# EasyEDA schematic SCH_ESP32-S2-UNO_Final_2023-12-28.json
TITLE: ESP32-32-CONTROL; REV: 1.0; Date: 2023-12-15; Sheet: 1/1; Drawn By: mubashirlio; Company: Your Company
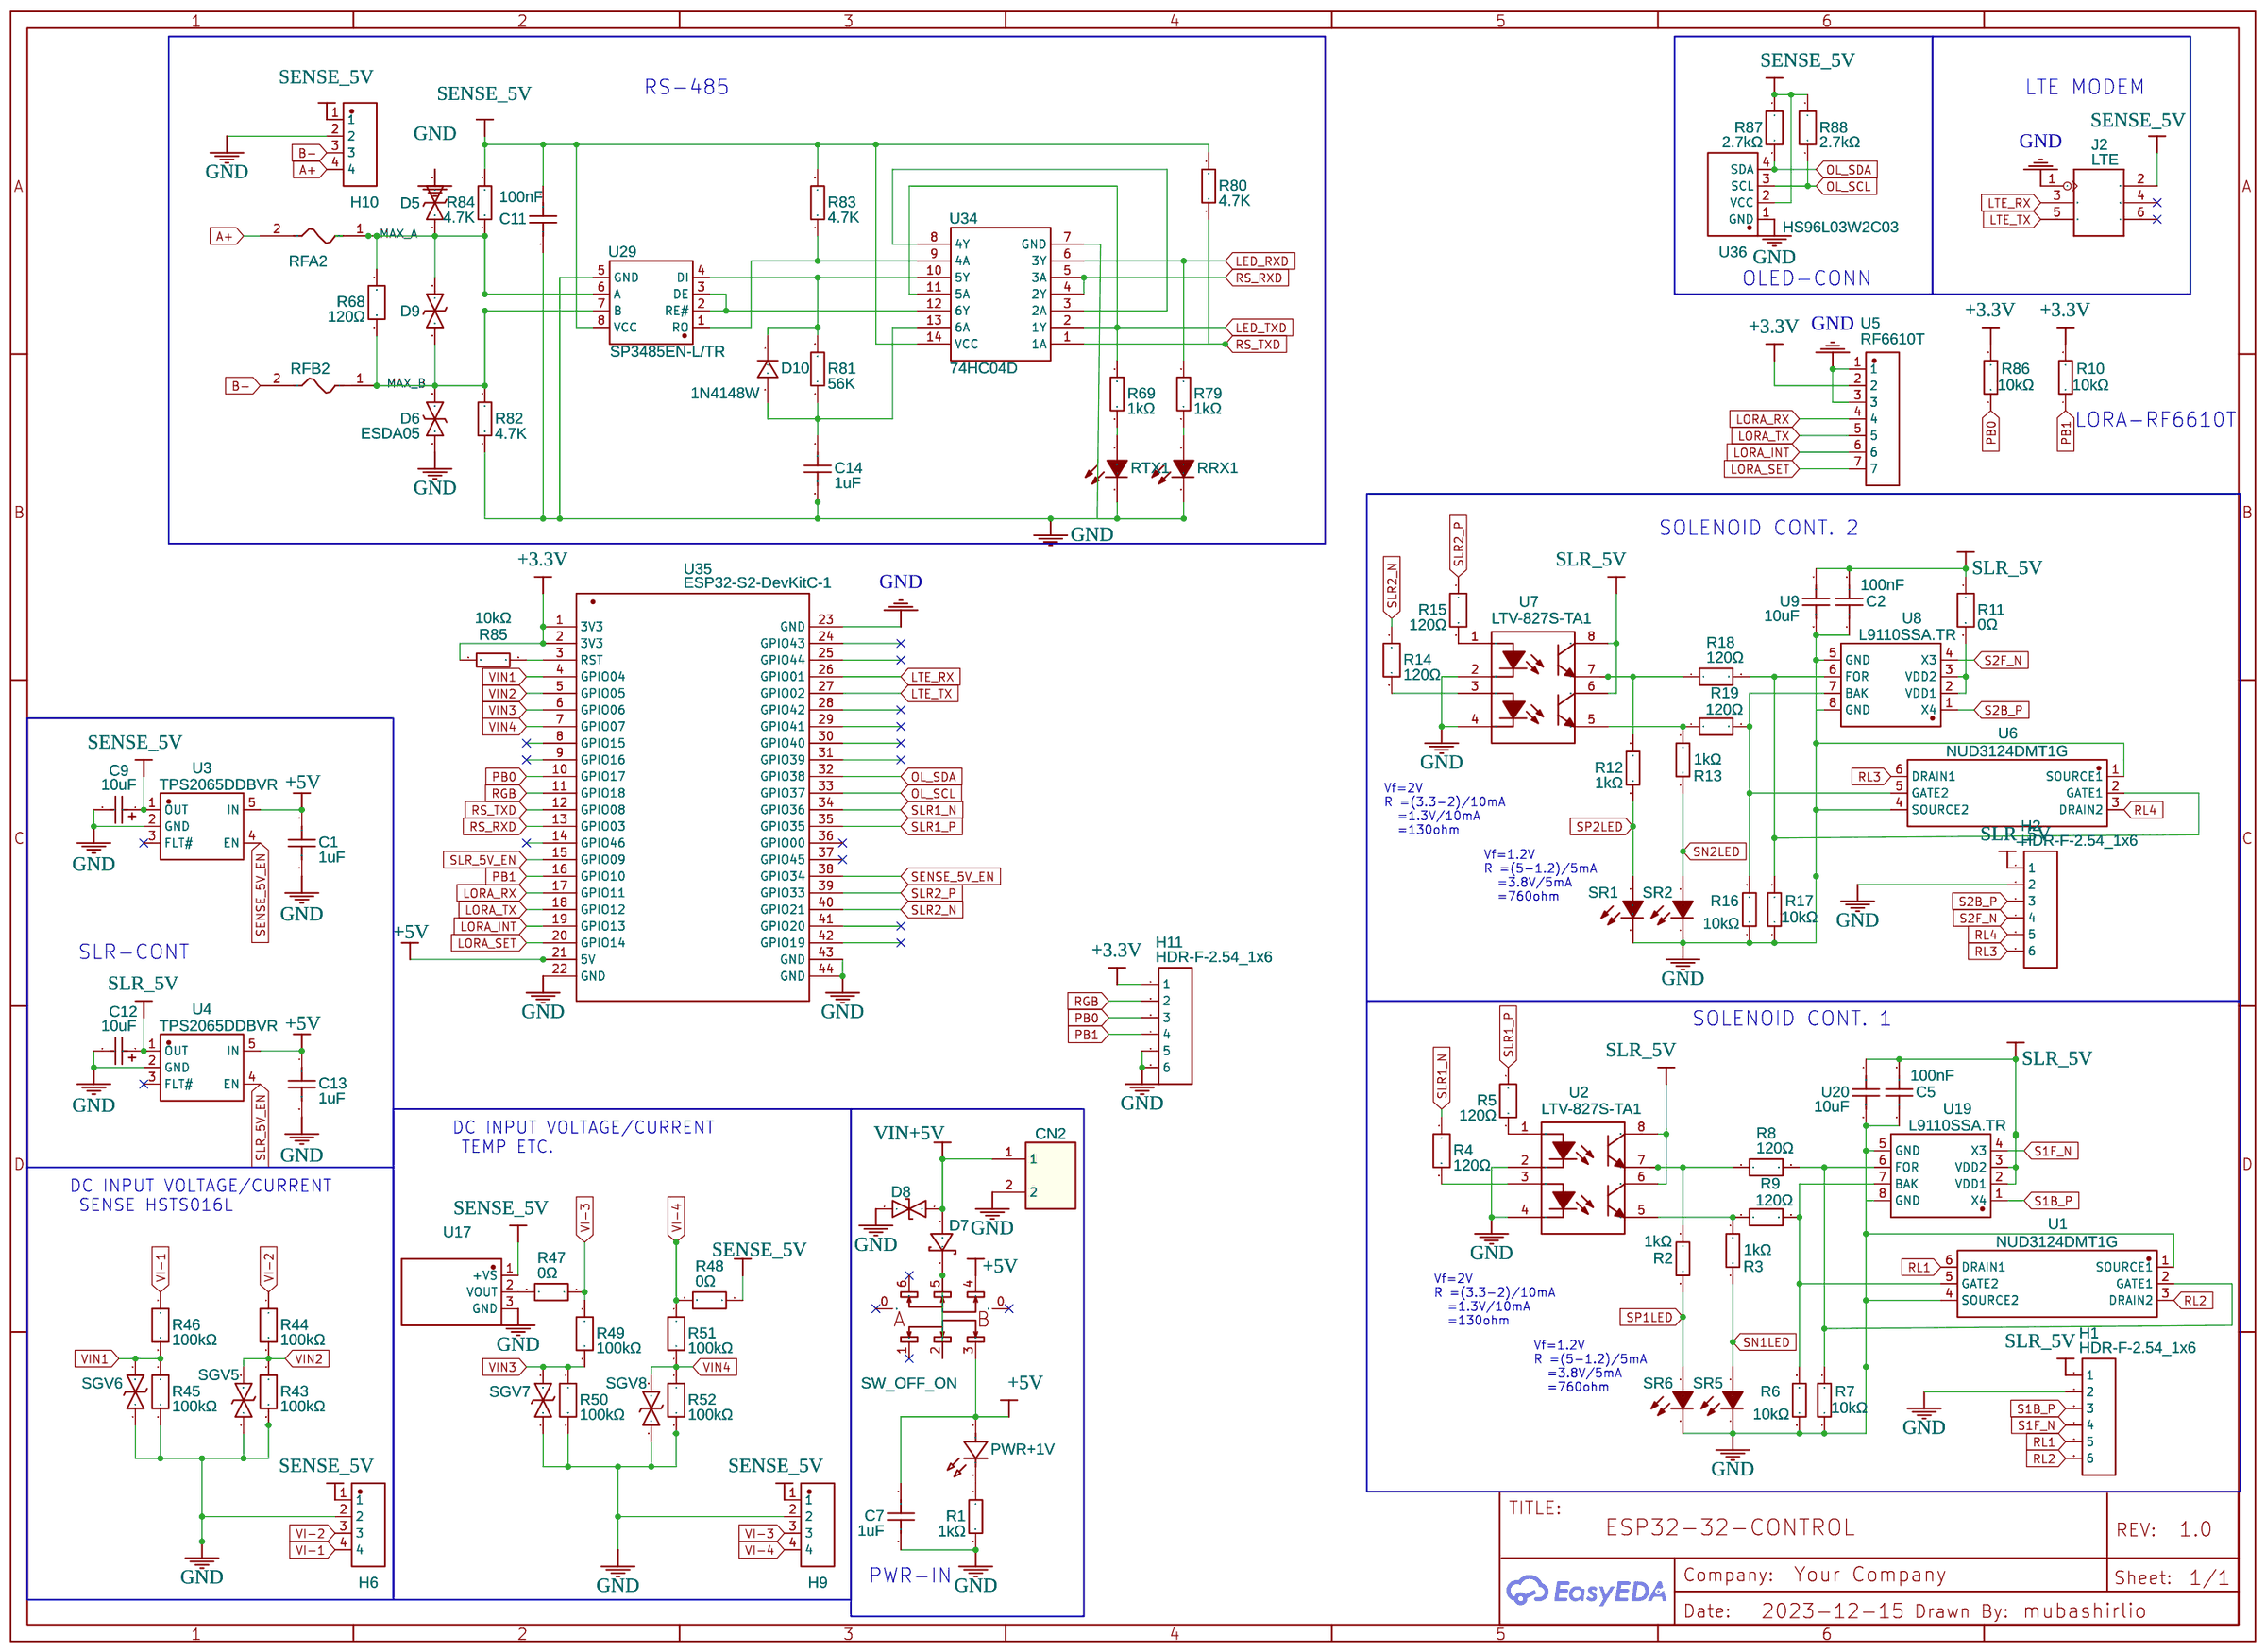
[diagram p0: schematic sheet]

## Parts
C1  1uF  [C0402]
C2  100nF  [C0402]
C5  100nF  [C0402]
C7  1uF  [C0402]
C9  10uF  [CASE-A_3216]
C11  100nF  [C0402]
C12  10uF  [CASE-A_3216]
C13  1uF  [C0402]
C14  1uF  [C0402]
CN2  B2B-PH-K-S(LF)(SN)  [CONN-TH_B2B-PH-K-S]
D5  ESDA05  [X1-DFN1006-2_L1.0-W0.6-BI]
D6  ESDA05  [X1-DFN1006-2_L1.0-W0.6-BI]
D7  BAT760-7  [SOD-323_L1.8-W1.3-LS2.5-RD]
D8  LESD5D5.0CT1G  [SOD-523_L1.2-W0.8-LS1.6-BI]
D9  ESDA05  [X1-DFN1006-2_L1.0-W0.6-BI]
D10  1N4148W  [SOD-123_L2.8-W1.8-LS3.7-RD]
H1  HDR-F-2.54_1x6  [HDR-F-2.54_1X6]
H2  HDR-F-2.54_1x6  [HDR-F-2.54_1X6]
H6  X6511WV-04H-C30D60  [HDR-TH_4P-P2.54-V-M]
H9  X6511WV-04H-C30D60  [HDR-TH_4P-P2.54-V-M]
H10  X6511WV-04H-C30D60  [HDR-TH_4P-P2.54-V-M]
H11  HDR-F-2.54_1x6  [HDR-F-2.54_1X6]
J2  LTE  [HEADER 2X3-2.54]
PWR+1V  16-213/BHC-ZL1M2B6Y/3T  [LED0402-RD_BLUE]
R1  1kΩ  [R0402]
R2  1kΩ  [R0402]
R3  1kΩ  [R0402]
R4  120Ω  [R0402]
R5  120Ω  [R0402]
R6  10kΩ  [R0402]
R7  10kΩ  [R0402]
R8  120Ω  [R0402]
R9  120Ω  [R0402]
R10  10kΩ  [R0402]
R11  0Ω  [R0603]
R12  1kΩ  [R0402]
R13  1kΩ  [R0402]
R14  120Ω  [R0402]
R15  120Ω  [R0402]
R16  10kΩ  [R0402]
R17  10kΩ  [R0402]
R18  120Ω  [R0402]
R19  120Ω  [R0402]
R43  100kΩ  [R0402]
R44  100kΩ  [R0402]
R45  100kΩ  [R0402]
R46  100kΩ  [R0402]
R47  0Ω  [R0603]
R48  0Ω  [R0603]
R49  100kΩ  [R0402]
R50  100kΩ  [R0402]
R51  100kΩ  [R0402]
R52  100kΩ  [R0402]
R68  120Ω  [R0603]
R69  1kΩ  [R0402]
R79  1kΩ  [R0402]
R80  4.7K  [R0603]
R81  56K  [R0603]
R82  4.7K  [R0603]
R83  4.7K  [R0603]
R84  4.7K  [R0603]
R85  10kΩ  [R0402]
R86  10kΩ  [R0402]
R87  2.7kΩ  [R0402]
R88  2.7kΩ  [R0402]
RFA2  MF-MSMF010-2  [F1812]
RFB2  MF-MSMF010-2  [F1812]
RRX1  16-213/GHC-YR1S1/3T  [LED0402-R-RD]
RTX1  16-213/SDRC/S530-A3/TR8  [LED0402-RD]
SGV5  ESDA05  [X1-DFN1006-2_L1.0-W0.6-BI]
SGV6  ESDA05  [X1-DFN1006-2_L1.0-W0.6-BI]
SGV7  ESDA05  [X1-DFN1006-2_L1.0-W0.6-BI]
SGV8  ESDA05  [X1-DFN1006-2_L1.0-W0.6-BI]
SR1  16-213/GHC-YR1S1/3T  [LED0402-R-RD]
SR2  16-213/SDRC/S530-A3/TR8  [LED0402-RD]
SR5  16-213/SDRC/S530-A3/TR8  [LED0402-RD]
SR6  16-213/GHC-YR1S1/3T  [LED0402-R-RD]
SW2  SW_OFF_ON  [SW-SMD_6P-L7.7-W5.6-P2.50]
U1  NUD3124DMT1G  [SC-74-6_L3.0-W1.5-P0.95-LS2.8-BL]
U2  LTV-827S-TA1  [SMD-8_6.3MM]
U3  TPS2065DDBVR  [SOT-23-5_L3.0-W1.7-P0.95-LS2.8-BL]
U4  TPS2065DDBVR  [SOT-23-5_L3.0-W1.7-P0.95-LS2.8-BL]
U5  RF6610T  [RF6610T]
U6  NUD3124DMT1G  [SC-74-6_L3.0-W1.5-P0.95-LS2.8-BL]
U7  LTV-827S-TA1  [SMD-8_6.3MM]
U8  L9110SSA.TR  [SOP-8_L5.0-W3.9-P1.27-LS6.0-BL]
U9  10uF  [C0603]
U17  LM35DZ/LFT1  [TO-92-3_L4.8-W3.7-P2.54-L]
U19  L9110SSA.TR  [SOP-8_L5.0-W3.9-P1.27-LS6.0-BL]
U20  10uF  [C0603]
U29  SP3485EN-L/TR  [SOIC-8_L5.0-W4.0-P1.27-LS6.0-BL]
U34  74HC04D  [SOIC-14_150MIL]
U35  ESP32-S2-DevKitC-1  [ESP32-S2-DEVKITC-1]
U36  HS96L03W2C03  [OLED-TH_L27.8-W27.2-P2.54_C9900033791]

## Library data of the parts
C1 C7 C13 C14 = GRM155R61H105ME05D: Contributor: lcsc; Supplier: LCSC; Supplier Part: C5119299; Manufacturer: muRata(村田); JLCPCB Part Class: Extended Part; link: https://lcsc.com/eda_search?q=C5119299&%26type=1&ref=editor
C2 C5 C11 = C1005X5R0J104K050BA: Contributor: lcsc; Supplier: LCSC; Supplier Part: C3845188; Manufacturer: TDK; link: https://lcsc.com/eda_search?q=C3845188&%26type=1&ref=editor
C9 C12 = CA45A-A-16V-10UF-K: Contributor: LCSC; Supplier: LCSC; Manufacturer: CEC(振华新云); Manufacturer Part: CA45A-A-16V-10uF-K; Supplier Part: C129279; JLCPCB Part Class: Extended Part
CN2 = B2B-PH-K-S(LF)(SN): Contributor: LCSC; Supplier: LCSC; Manufacturer: JST; Supplier Part: C131337; JLCPCB Part Class: Extended Part; link: https://lcsc.com/eda_search?q=C131337&%26type=1&ref=editor
D5 D6 D9 SGV5-SGV8 = ESDA05: Supplier: LCSC; Supplier Part: C2836909; Manufacturer: Leiditech(雷卯电子); Contributor: lcsc; JLCPCB Part Class: Extended Part
D7 = BAT760-7: Contributor: LCSC; Supplier: LCSC; Manufacturer: DIODES(美台); Supplier Part: C124187; JLCPCB Part Class: Extended Part; link: https://lcsc.com/eda_search?q=C124187&%26type=1&ref=editor
D8 = LESD5D5.0CT1G: Contributor: LCSC; Supplier: LCSC; Supplier Part: C383211; Manufacturer: LRC(乐山无线电); JLCPCB Part Class: Extended Part; link: https://lcsc.com/eda_search?q=C383211&%26type=1&ref=editor
D10 = 1N4148W_C81598: Supplier: LCSC; Manufacturer: SEMTECH; image: //image.lceda.cn/szlcsc/C81598.jpg; Supplier Part: C81598; LCSC Assembly: Yes; SMT Type: Basic
H1 H2 H11 = HDR-F-2.54_1x6: Supplier Part: C40877; Supplier: LCSC; Contributor: LCEDA_Lib
H6 H9 H10 = X6511WV-04H-C30D60: Contributor: LCSC; Supplier: LCSC; Supplier Part: C706876; Manufacturer: XKB Connectivity(中国星坤); JLCPCB Part Class: Extended Part
J2 = MALE-HEADER(2X3P-2.54): Contributor: hphoa
PWR+1V = 16-213/BHC-ZL1M2B6Y/3T: Contributor: lcsc; Supplier: LCSC; Supplier Part: C2844007; Manufacturer: EVERLIGHT(亿光); JLCPCB Part Class: Extended Part
R1-R3 R12 R13 R69 R79 = AR02DTD1001: Contributor: LCSC; Supplier: LCSC; Supplier Part: C319807; Manufacturer: Viking(光颉); JLCPCB Part Class: Extended Part; link: https://lcsc.com/eda_search?q=C319807&%26type=1&ref=editor
R4 R5 R8 R9 R14 R15 R18 R19 = RM04FTN1200: Contributor: LCSC; Supplier: LCSC; Supplier Part: C432822; Manufacturer: 大毅科技; JLCPCB Part Class: Extended Part; link: https://lcsc.com/eda_search?q=C432822&%26type=1&ref=editor
R6 R7 R10 R16 R17 R85 R86 = 0402WGF1002TCE: Supplier: LCSC; Manufacturer: UNI-ROYAL(厚声); Supplier Part: C25744; JLCPCB Part Class: Basic Part; link: https://lcsc.com/eda_search?q=C25744&%26type=1&ref=editor; Package Display: No
R11 R47 R48 = CR-03JA7----0R: Contributor: LCSC; Supplier: LCSC; Supplier Part: C465460; Manufacturer: Viking(光颉); JLCPCB Part Class: Extended Part; link: https://lcsc.com/eda_search?q=C465460&%26type=1&ref=editor
R43-R46 R49-R52 = CQ02WGJ0104TCE: Contributor: LCSC; Supplier: LCSC; Supplier Part: C966710; Manufacturer: UNI-ROYAL(厚声); JLCPCB Part Class: Extended Part; link: https://lcsc.com/eda_search?q=C966710&%26type=1&ref=editor
R68 = FRC0603J121 TS: Contributor: lcsc; Supplier: LCSC; Supplier Part: C2907096; Manufacturer: FOJAN(富捷); JLCPCB Part Class: Extended Part; link: https://lcsc.com/eda_search?q=C2907096&%26type=1&ref=editor
R80 R82-R84 = 0603WAF4701T5E: Supplier: LCSC; Manufacturer: UniOhm; LCSC Assembly: Yes; Supplier Part: C23162; SMT Type: Basic
R81 = 0603WAF5602T5E: Supplier: LCSC; Manufacturer: UniOhm; LCSC Assembly: Yes; Supplier Part: C23206; SMT Type: Basic
R87 R88 = CR-02FL6---2K7: Contributor: LCSC; Supplier: LCSC; Supplier Part: C409687; Manufacturer: Viking(光颉); JLCPCB Part Class: Extended Part; link: https://lcsc.com/eda_search?q=C409687&%26type=1&ref=editor
RFA2 RFB2 = MF-MSMF010-2: Supplier: LCSC; Manufacturer: BOURNS; Supplier Part: C12430; JLCPCB Part Class: Extended Part
RRX1 SR1 SR6 = 16-213/GHC-YR1S1/3T: Supplier: LCSC; Manufacturer: EVERLIGHT(亿光); Supplier Part: C74338; JLCPCB Part Class: Extended Part
RTX1 SR2 SR5 = 16-213/SDRC/S530-A3/TR8: Supplier: LCSC; Manufacturer: EVERLIGHT(亿光); Manufacturer Part: 16-213SDRC/S530-A3/TR8; Supplier Part: C71911; JLCPCB Part Class: Extended Part
SW2 = TA-3519S-A1: Contributor: LCSC; Supplier: LCSC; Supplier Part: C514002; Manufacturer: Yuandi(元迪); JLCPCB Part Class: Extended Part; link: https://lcsc.com/eda_search?q=C514002&%26type=1&ref=editor
U1 U6 = NUD3124DMT1G: Supplier: LCSC; Supplier Part: C182473; Manufacturer: ON Semicon; Contributor: LCSC; JLCPCB Part Class: Extended Part
U2 U7 = -: Supplier: LCSC; Manufacturer: LITEON; Supplier Part: C22112; Package Display: No
U3 U4 = TPS2065DDBVR: Contributor: LCSC; Supplier: LCSC; Supplier Part: C414625; Manufacturer: TI(德州仪器); JLCPCB Part Class: Extended Part
U5 = RF6610T: Contributor: aamirf; Supplier: LCSC; Supplier Part: C2897370; Manufacturer: HCTL(华灿天禄); Manufacturer Part: PM254-1-07-Z-8.5; JLCPCB Part Class: Extended Part
U8 U19 = L9110SSA.TR: Supplier: LCSC; Supplier Part: C2977409; Manufacturer: I-CORE(中微爱芯); link: https://atta.szlcsc.com//upload/public/pdf/source/20220218/3C4A07BB3A14956AC9371DCD7606795B.pdf; Contributor: LCSC; JLCPCB Part Class: Extended Part
U9 U20 = CGB3C1JB0J106M065AC: Contributor: lcsc; Supplier: LCSC; Supplier Part: C3853014; Manufacturer: TDK; link: https://lcsc.com/eda_search?q=C3853014&%26type=1&ref=editor
U17 = LM35DZ/LFT1: Contributor: LCSC; Supplier: LCSC; Manufacturer: TI(德州仪器); Supplier Part: C181511; JLCPCB Part Class: Extended Part; link: https://lcsc.com/eda_search?q=C181511&%26type=1&ref=editor
U29 = SP3485EN-L/TR: Supplier: LCSC; Manufacturer: EXAR; LCSC Assembly: Yes; image: //image.lceda.cn/szlcsc/C8963.jpg; Supplier Part: C8963; SMT Type: Basic
U34 = -: Supplier: LCSC; Manufacturer: Nexperia; Manufacturer Part: 74HC04D,653; LCSC Assembly: Yes; image: //image.lceda.cn/szlcsc/C5590.jpg; Supplier Part: C5590; SMT Type: Basic
U35 = ESP32-S2-DevKitC-1: Manufacturer: Espressif Manifacturer; Supplier: Mouser; link: https://www.espressif.com/en/products/socs/esp32-s2; Contributor: kung
U36 = HS96L03W2C03: Contributor: lcsc; Supplier: LCSC; Supplier Part: C5248080; Manufacturer: HS(汉昇); JLCPCB Part Class: Extended Part; link: https://lcsc.com/eda_search?q=C5248080&%26type=1&ref=editor

## Nets
+3.3V: H11.1 R10.2 R85.1 R86.2 U5.2 U35.1(3V3) U35.2(3V3)
+5V: C1.1 C7.1 C13.1 PWR+1V.2(A) SW2.3 SW2.4 U3.5(IN) U4.5(IN) U35.21(5V)
GND: C1.2 C2.1 C5.1 C7.2 C9.2 C11.1 C12.2 C13.2 C14.2 CN2.2 D5.1 D6.1 D8.1 H1.2 H2.2 H6.2 H9.2 H10.2 H11.5 H11.6 J2.1 R1.2 R6.1 R7.1 R16.1 R17.1 R43.2 R45.2 R50.2 R52.2 R82.1 RRX1.2(C) RTX1.1(-) SGV5.1 SGV6.1 SGV7.1 SGV8.1 SR1.2(C) SR2.1(-) SR5.1(-) SR6.2(C) U1.1(SOURCE1) U1.4(SOURCE2) U2.2 U2.4 U3.2(GND) U4.2(GND) U5.1 U5.3 U6.1(SOURCE1) U6.4(SOURCE2) U7.2 U7.4 U8.5(GND) U8.8(GND) U9.2 U17.3(GND) U19.5(GND) U19.8(GND) U20.2 U29.5(GND) U34.7(GND) U35.22(GND) U35.23(GND) U35.43(GND) U35.44(GND) U36.1(GND)
VIN1: R45.1 R46.2 SGV6.2 U35.4(GPIO04)
VIN2: R43.1 R44.2 SGV5.2 U35.5(GPIO05)
VIN3: R49.2 R50.1 SGV7.2 U35.6(GPIO06)
VIN4: R51.2 R52.1 SGV8.2 U35.7(GPIO07)
VIN+5V: CN2.1 D7.2 D8.2
A+: H10.4 RFA2.2
B-: H10.3 RFB2.2
LED_RXD: R79.1 U34.6(3Y)
LED_TXD: R69.1 U34.2(1Y) U34.11(5A)
LORA_INT: U5.6 U35.19(GPIO13)
LORA_RX: U5.4 U35.17(GPIO11)
LORA_SET: U5.7 U35.20(GPIO14)
LORA_TX: U5.5 U35.18(GPIO12)
LTE_RX: J2.3(2) U35.26(GPIO01)
LTE_TX: J2.5(3) U35.27(GPIO02)
MAX_A: D5.2 D9.1 R68.1 R84.1 RFA2.1 U29.6(A)
MAX_B: D6.2 D9.2 R68.2 R82.2 RFB2.1 U29.7(B)
OL_SCL: R88.2 U35.33(GPIO37) U36.3(SCL)
OL_SDA: R87.2 U35.32(GPIO38) U36.4(SDA)
PB0: H11.3 R86.1 U35.10(GPIO17)
PB1: H11.4 R10.1 U35.16(GPIO10)
RGB: H11.2 U35.11(GPIO18)
RL1: H1.5 U1.6(DRAIN1)
RL2: H1.6 U1.3(DRAIN2)
RL3: H2.6 U6.6(DRAIN1)
RL4: H2.5 U6.3(DRAIN2)
RS_RXD: U34.4(2Y) U34.5(3A) U35.13(GPIO03)
RS_TXD: R80.1 U34.1(1A) U35.12(GPIO08)
S1B_P: H1.3 U19.1(X4)
S1F_N: H1.4 U19.4(X3)
S2B_P: H2.3 U8.1(X4)
S2F_N: H2.4 U8.4(X3)
SENSE_5V: C9.1 C11.2 H6.1 H9.1 H10.1 J2.2(6) R48.1 R80.2 R83.2 R84.2 R87.1 R88.1 U3.1(OUT) U17.1(+VS) U29.8(VCC) U34.14(VCC) U36.2(VCC)
SENSE_5V_EN: U3.4(EN) U35.38(GPIO34)
SLR1_N: R4.1 U35.34(GPIO36)
SLR1_P: R5.1 U35.35(GPIO35)
SLR2_N: R14.1 U35.40(GPIO21)
SLR2_P: R15.1 U35.39(GPIO33)
SLR_5V: C2.2 C5.2 C12.1 H1.1 H2.1 R11.1 U2.6 U2.8 U4.1(OUT) U7.6 U7.8 U9.1 U19.2(VDD1) U19.3(VDD2) U20.1
SLR_5V_EN: U4.4(EN) U35.15(GPIO09)
SN1LED: R3.2 SR5.2(+)
SN2LED: R13.2 SR2.2(+)
SP1LED: R2.2 SR6.1(A)
SP2LED: R12.2 SR1.1(A)
VI-1: H6.4 R46.1
VI-2: H6.3 R44.1
VI-3: H9.3 R47.1 R49.1
VI-4: H9.4 R48.2 R51.1
Net-(C14-1): C14.1 D10.2(A) R81.1 U34.13(6A)
Net-(D7-1): D7.1 SW2.2 SW2.5
Net-(D10-1): D10.1(K) R81.2 U29.4(DI) U34.10(5Y)
Net-(PWR+1V-1): PWR+1V.1(K) R1.1
Net-(R2-1): R2.1 R8.1 U2.7
Net-(R3-1): R3.1 R9.1 U2.5
Net-(R4-2): R4.2 U2.3
Net-(R5-2): R5.2 U2.1
Net-(R6-2): R6.2 R9.2 U1.5(GATE2) U19.7(BAK)
Net-(R7-2): R7.2 R8.2 U1.2(GATE1) U19.6(FOR)
Net-(R11-2): R11.2 U8.2(VDD1) U8.3(VDD2)
Net-(R12-1): R12.1 R18.1 U7.7
Net-(R13-1): R13.1 R19.1 U7.5
Net-(R14-2): R14.2 U7.3
Net-(R15-2): R15.2 U7.1
Net-(R16-2): R16.2 R19.2 U6.5(GATE2) U8.7(BAK)
Net-(R17-2): R17.2 R18.2 U6.2(GATE1) U8.6(FOR)
Net-(R47-2): R47.2 U17.2(VOUT)
Net-(R69-2): R69.2 RTX1.2(+)
Net-(R79-2): R79.2 RRX1.1(A)
Net-(R83-1): R83.1 U29.1(RO) U34.9(4A)
Net-(R85-2): R85.2 U35.3(RST)
Net-(U29-2): U29.2(RE#) U29.3(DE) U34.12(6Y)
Net-(U34-3): U34.3(2A) U34.8(4Y)

Not connected (* = marked no-connect by the designer): J2 4(5)* 6(4)*; SW2 0* 1* 6*; U3 3(FLT#)*; U4 3(FLT#)*; U35 8(GPIO15) 9(GPIO16) 14(GPIO46) 24(GPIO43) 25(GPIO44) 28(GPIO42) 29(GPIO41) 30(GPIO40) 31(GPIO39) 36(GPIO00)* 37(GPIO45)* 41(GPIO20) 42(GPIO19)

## Notes on the sheet
- RS-485
- LTE MODEM
- OLED-CONN
- LORA-RF6610T
- SOLENOID CONT. 2
- Vf=2V
  R =(3.3-2)/10mA
    =1.3V/10mA
    =130ohm
- Vf=1.2V
  R =(5-1.2)/5mA
    =3.8V/5mA
    =760ohm
- SLR-CONT
- SOLENOID CONT. 1
- DC INPUT VOLTAGE/CURRENT
   TEMP ETC.
- DC INPUT VOLTAGE/CURRENT
   SENSE HSTS016L
- Vf=2V
  R =(3.3-2)/10mA
    =1.3V/10mA
    =130ohm
- Vf=1.2V
  R =(5-1.2)/5mA
    =3.8V/5mA
    =760ohm
- PWR-IN
